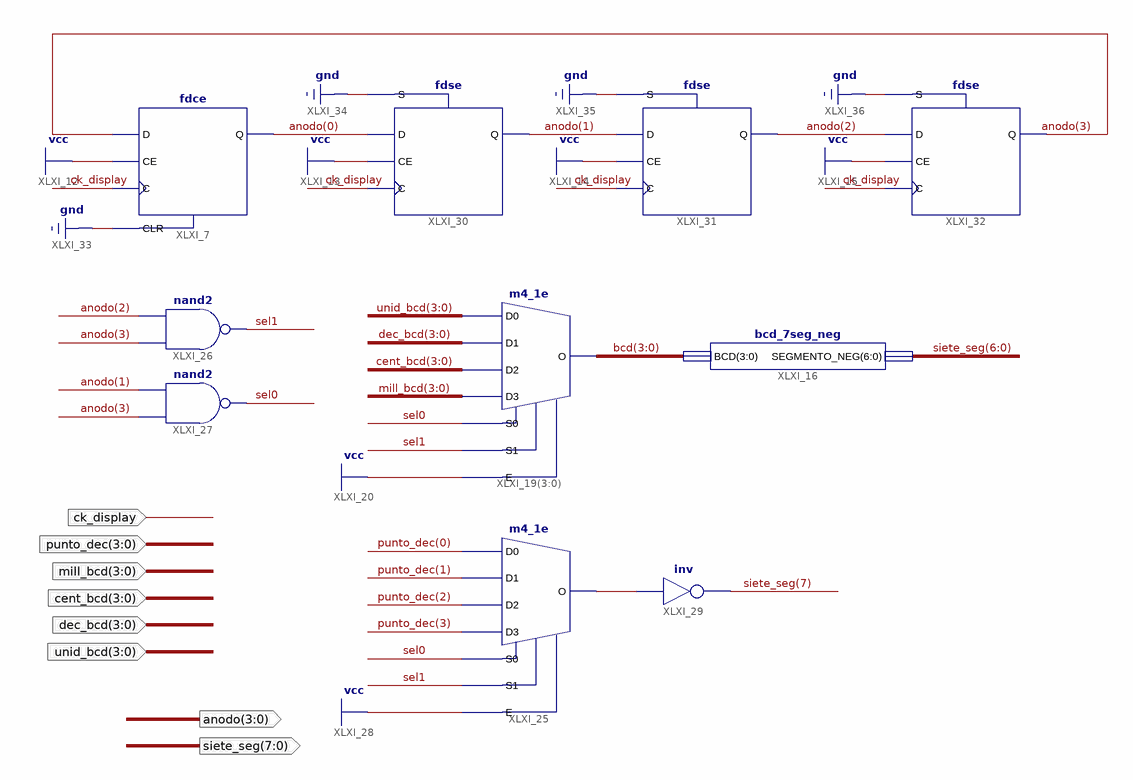
[diagram p0: schematic sheet 1]
// Xilinx ISE schematic displays_7seg_nexys3.sch (spartan6) as structural Verilog: 10 symbols, 8 ports
module displays_7seg_nexys3 (
  input  [3:0] mill_bcd,
  input  [3:0] cent_bcd,
  input  [3:0] dec_bcd,
  input  [3:0] unid_bcd,
  input  [3:0] punto_dec,
  input  ck_display,
  output [3:0] anodo,
  output [7:0] siete_seg
);

  wire sel0, sel1, XLXN_57;
  wire [3:0] bcd;

  fdce XLXI_7 (.C(ck_display), .CE(1'b1), .CLR(1'b0), .D(anodo[3]), .Q(anodo[0]));
  m4_1e XLXI_19[3:0] (
    .D0(unid_bcd), .D1(dec_bcd), .D2(cent_bcd), .D3(mill_bcd), .E(1'b1), .S0(sel0), .S1(sel1), .O(bcd));
  bcd_7seg_neg XLXI_16 (.BCD(bcd), .SEGMENTO_NEG(siete_seg[6:0]));
  m4_1e XLXI_25 (
    .D0(punto_dec[0]), .D1(punto_dec[1]), .D2(punto_dec[2]), .D3(punto_dec[3]), .E(1'b1), .S0(sel0),
    .S1(sel1), .O(XLXN_57));
  nand XLXI_26 (sel1, anodo[3], anodo[2]);
  nand XLXI_27 (sel0, anodo[3], anodo[1]);
  not XLXI_29 (siete_seg[7], XLXN_57);
  fdse XLXI_30 (.C(ck_display), .CE(1'b1), .D(anodo[0]), .S(1'b0), .Q(anodo[1]));
  fdse XLXI_31 (.C(ck_display), .CE(1'b1), .D(anodo[1]), .S(1'b0), .Q(anodo[2]));
  fdse XLXI_32 (.C(ck_display), .CE(1'b1), .D(anodo[2]), .S(1'b0), .Q(anodo[3]));
endmodule
